# EAGLE design camera board V1 (EAGLE 7.3.0)
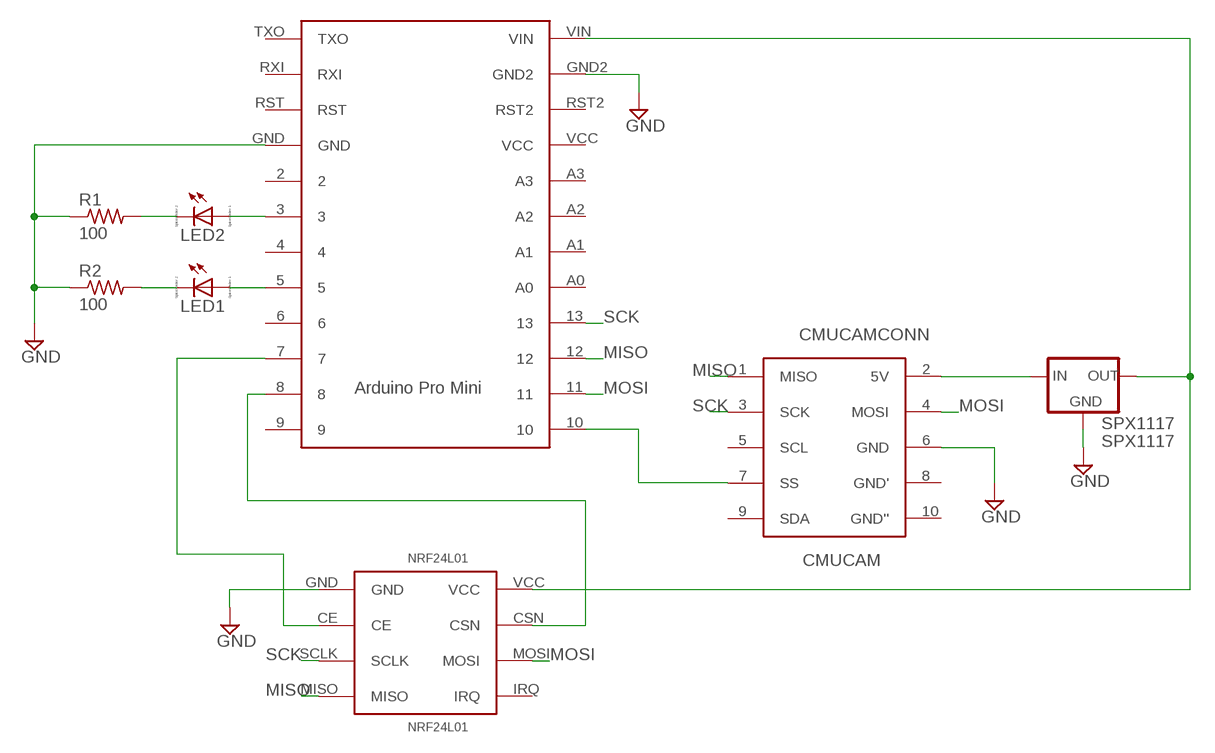
[diagram p0: schematic, sheet 1]

## Parts
ARDUINOPROMINI  ARDUINOPROMINI  [ARDUINOPROMINI]
CMUCAM  CMUCAMCONN  [DIP10]
LED1  LED_E  [LED_1206]
LED2  LED_E  [LED_1206]
NRF24L01  NRF24L01  [DIP8]
R1  100  R-US_M1206  [M1206]
R2  100  R-US_M1206  [M1206]
SPX1117  SPX1117  [SOT-223]

## Nets
GND: ARDUINOPROMINI.GND ARDUINOPROMINI.GND2 CMUCAM.6(GND) NRF24L01.GND R1.1 R2.1 SPX1117.1(GND)
MISO: ARDUINOPROMINI.12 CMUCAM.1(MISO) NRF24L01.MISO
MOSI: ARDUINOPROMINI.11 CMUCAM.4(MOSI) NRF24L01.MOSI
N$1: CMUCAM.2(5V) SPX1117.3(IN)
N$2: ARDUINOPROMINI.VIN NRF24L01.VCC SPX1117.2(OUT)
N$3: ARDUINOPROMINI.8 NRF24L01.CSN
N$4: ARDUINOPROMINI.7 NRF24L01.CE
N$5: LED1.C R2.2
N$6: ARDUINOPROMINI.5 LED1.A
N$7: ARDUINOPROMINI.10 CMUCAM.7(SS)
N$8: ARDUINOPROMINI.3 LED2.A
N$9: LED2.C R1.2
SCK: ARDUINOPROMINI.13 CMUCAM.3(SCK) NRF24L01.SCLK
Unconnected: ARDUINOPROMINI.2 ARDUINOPROMINI.4 ARDUINOPROMINI.6 ARDUINOPROMINI.9 ARDUINOPROMINI.A0 ARDUINOPROMINI.A1 ARDUINOPROMINI.A2 ARDUINOPROMINI.A3 ARDUINOPROMINI.RST ARDUINOPROMINI.RST2 ARDUINOPROMINI.RXI ARDUINOPROMINI.TXO ARDUINOPROMINI.VCC CMUCAM.5(SCL) CMUCAM.8(GND') CMUCAM.9(SDA) CMUCAM.10(GND'') NRF24L01.IRQ

## Library data of the parts
ARDUINOPROMINI = IrTag library:ARDUINOPROMINI
CMUCAM = julesthuillier:CMUCAMCONN
LED1 LED2 = eagle-ltspice:LED_E: LED Source: http://www.osram.convergy.de Source: www.luxeon.com Source: www.kingbright.com; SPICEMODEL: NONE; SPICEPREFIX: D; SPICETYPE: diode
NRF24L01 = julesthuillier:NRF24L01
R1 R2 = resistor:R-US_: RESISTOR, American symbol
SPX1117 = IrTag library:SPX1117

## Board
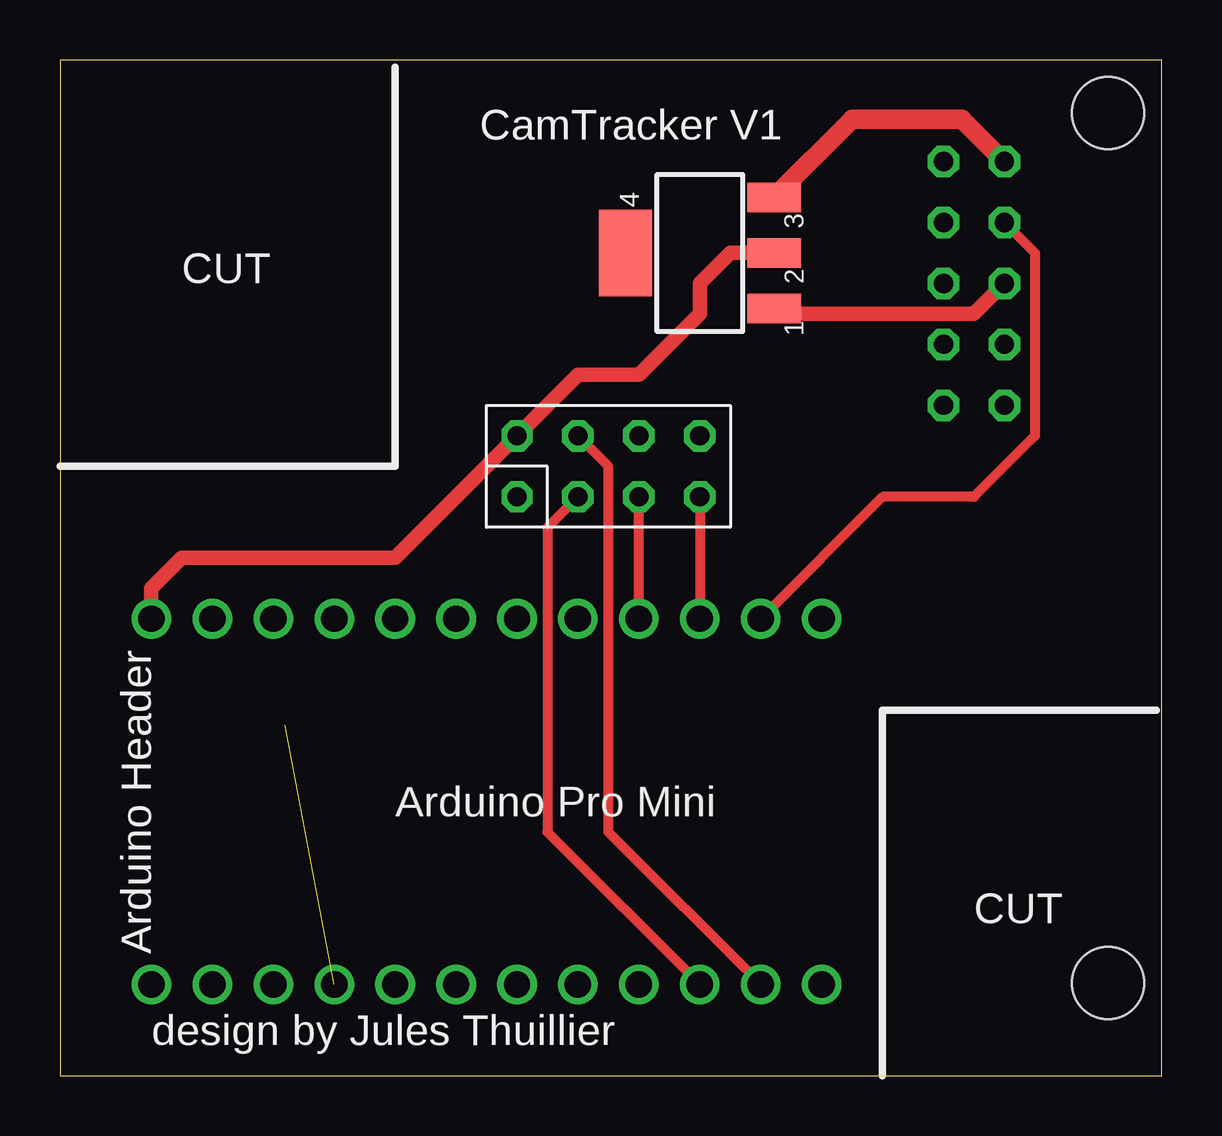
[diagram p1: board, top side]
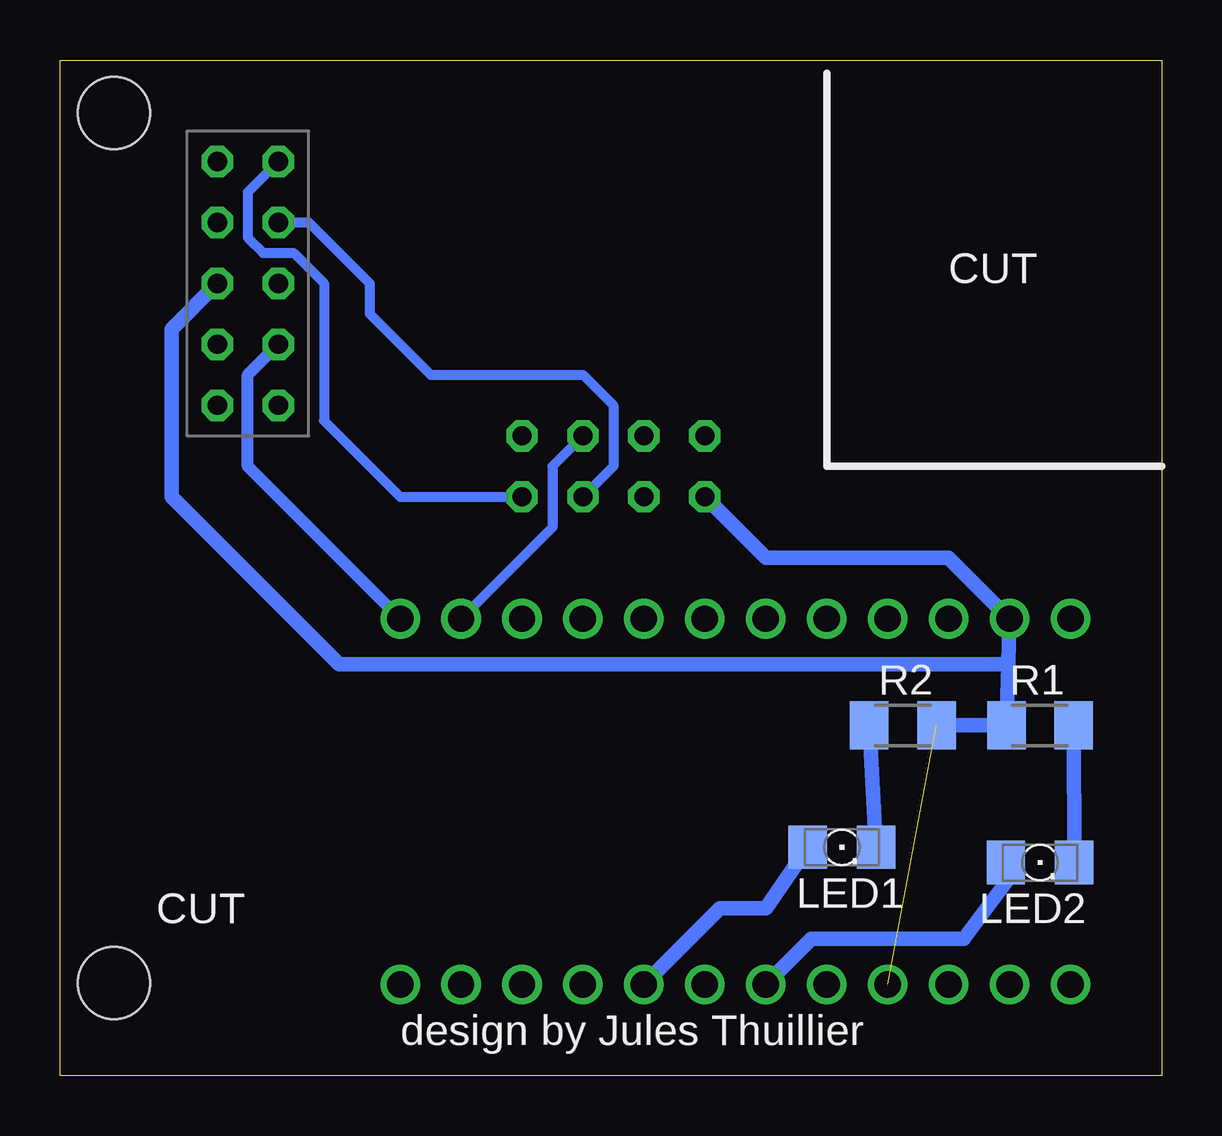
[diagram p2: board, bottom side, seen from below]

Size 45.93 x 42.33 mm. Coordinates in mm from the lower left corner, seen from the top.
Outline: 0,0 45.93,0 45.93,42.33 0,42.33 0,0
Copper layers (1*16): Top 0.035mm / dielectric 1.5mm / Bottom 0.035mm
Design rules "default": minimum track width 10mil, minimum drill 24mil, track to track 8mil, track to pad 8mil, pad to pad 8mil, via to via 8mil, smd to smd 8mil, copper to edge 40mil, drill to drill 8mil, minimum pad ring 10mil, minimum via ring 8mil, stop-mask expansion 4mil, vias tented up to drill 0mil, thermal gap 10mil
Holes 3 mm at 43.68,40.12 43.68,3.87

### Footprints (pad centres in the part's own frame; a part is rotated, then mirrored left to right if it is on the bottom)
ARDUINOPROMINI = drill 1.1: 2 -7.62,2.54; 3 -7.62,0; 4 -7.62,-2.54; 5 -7.62,-5.08; 6 -7.62,-7.62; 7 -7.62,-10.16; 8 -7.62,-12.7; 9 -7.62,-15.24; 10 7.62,-15.24; 11 7.62,-12.7; 12 7.62,-10.16; 13 7.62,-7.62; A0 7.62,-5.08; A1 7.62,-2.54; A2 7.62,0; A3 7.62,2.54; GND -7.62,5.08; GND2 7.62,10.16; RST -7.62,7.62; RST2 7.62,7.62; RXI -7.62,10.16; TXO -7.62,12.7; VCC 7.62,5.08; VIN 7.62,12.7
DIP10 = drill 0.8 octagon: 1 -1.27,-5.08; 2 1.27,-5.08; 3 -1.27,-2.54; 4 1.27,-2.54; 5 -1.27,0; 6 1.27,0; 7 -1.27,2.54; 8 1.27,2.54; 9 -1.27,5.08; 10 1.27,5.08
LED_1206 = smd 1.6 x 1.803: A -1.422,0; C 1.422,0
DIP8 = drill 0.8 octagon: CE -1.27,1.27; CSN 1.27,1.27; GND -1.27,3.81; IRQ 1.27,-3.81; MISO -1.27,-3.81; MOSI 1.27,-1.27; SCLK -1.27,-1.27; VCC 1.27,3.81
M1206 = smd 1.6 x 2: 1 -1.4,0; 2 1.4,0
SOT-223 = smd 1.219 x 2.235: 1 -2.311,-3.099; 2 0,-3.099; 3 2.311,-3.099 | smd 3.6 x 2.2: 4 0,3.099

### Placement (x,y rotation side)
ARDUINOPROMINI  16.51,11.43 90 top
CMUCAM  38.1,33.02 180 bottom
LED1  13.34,9.53 0 bottom
LED2  5.08,8.89 0 bottom
NRF24L01  22.86,25.4 90 top
R1  5.08,14.61 0 bottom
R2  10.79,14.61 180 bottom
SPX1117  26.67,34.29 90 top

### Tracks (layer width: path | path; a pad name or v marks a point on that pad's centre or on a via)
GND  (2 unrouted)
  Top 0.61: 30.48,31.75 30,31.75 SPX1117.1 30.25,31.98 30.48,31.75 | 30.48,31.75 38.1,31.75 CMUCAM.6
  Bottom 0.61: R2.1 R1.1 6.41,17.13 | 6.41,17.13 ARDUINOPROMINI.GND2 8.89,21.59 16.51,21.59 NRF24L01.GND | CMUCAM.6 41.27,31.11 41.27,24.13 34.29,17.14 6.42,17.14 6.41,17.13
MISO
  Top 0.406: NRF24L01.MISO ARDUINOPROMINI.12
  Bottom 0.406: CMUCAM.1 38.1,36.83 38.1,34.92 37.47,34.29 36.2,34.29 34.92,33.02 34.92,27.3 31.75,24.13 NRF24L01.MISO
MOSI
  Top 0.406: CMUCAM.4 40.64,34.29 40.64,26.67 38.1,24.13 34.29,24.13 ARDUINOPROMINI.11
  Bottom 0.406: NRF24L01.MOSI 25.4,25.4 25.4,22.86 ARDUINOPROMINI.11
N$1
  Top 0.813: CMUCAM.2 37.6,39.87 33.04,39.87 SPX1117.3
N$2
  Top 0.61: SPX1117.2 27.94,34.29 26.67,33.02 26.67,31.75 24.13,29.21 21.59,29.21 NRF24L01.VCC 13.97,21.59 5.08,21.59 3.81,20.32 ARDUINOPROMINI.VIN
N$3
  Top 0.406: ARDUINOPROMINI.8 22.86,10.16 22.86,25.4 NRF24L01.CSN
N$4
  Top 0.406: NRF24L01.CE 20.32,22.86 20.32,10.16 ARDUINOPROMINI.7
N$5
  Bottom 0.61: LED1.C R2.2
N$6
  Bottom 0.61: ARDUINOPROMINI.5 18.41,6.99 16.51,6.99 LED1.A
N$7
  Bottom 0.508: ARDUINOPROMINI.10 38.1,25.4 38.1,29.21 CMUCAM.7
N$8
  Bottom 0.61: ARDUINOPROMINI.3 14.61,5.71 8.26,5.71 6.35,8.26 LED2.A
N$9
  Bottom 0.61: LED2.C R1.2
SCK
  Top 0.406: ARDUINOPROMINI.13 NRF24L01.SCLK
  Bottom 0.406: CMUCAM.3 35.56,35.56 33.02,33.02 33.02,31.75 30.48,29.21 24.13,29.21 22.86,27.94 22.86,25.4 NRF24L01.SCLK

### Text on the board
tPlace: CamTracker V1 | CUT | Arduino Pro Mini | CUT | Arduino Header
bPlace: CUT | CUT
tNames: design by Jules Thuillier
bNames: design by Jules Thuillier